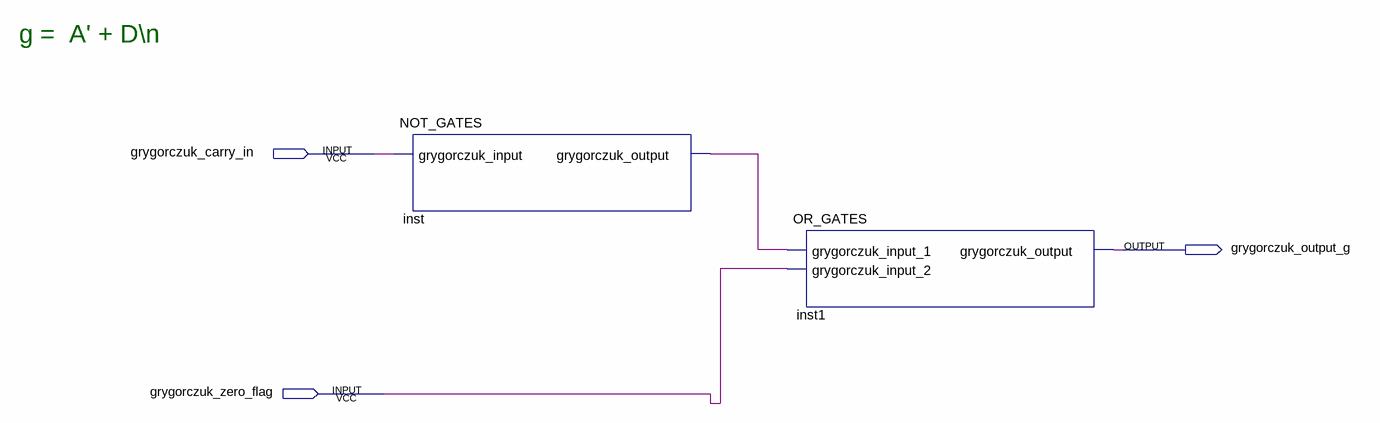
[diagram p0: schematic sheet]
// Quartus schematic SEVEN_SEGMENT_DISPLAY_PLUS_MINUS_ONE_D.bdf as structural Verilog: 2 symbols, 3 pins
module SEVEN_SEGMENT_DISPLAY_PLUS_MINUS_ONE_D (
  input  grygorczuk_carry_in,
  input  grygorczuk_zero_flag,
  output grygorczuk_output_g
);

  wire inst_grygorczuk_output;

  NOT_GATES inst (.grygorczuk_input(grygorczuk_carry_in), .grygorczuk_output(inst_grygorczuk_output));
  OR_GATES inst1 (
    .grygorczuk_input_1(inst_grygorczuk_output), .grygorczuk_input_2(grygorczuk_zero_flag),
    .grygorczuk_output(grygorczuk_output_g));

  // Notes on the sheet:
  //   g =  A' + D\n
endmodule
